# EAGLE design mainbrd (EAGLE 6.5.0)

## Sheet 1 of 2
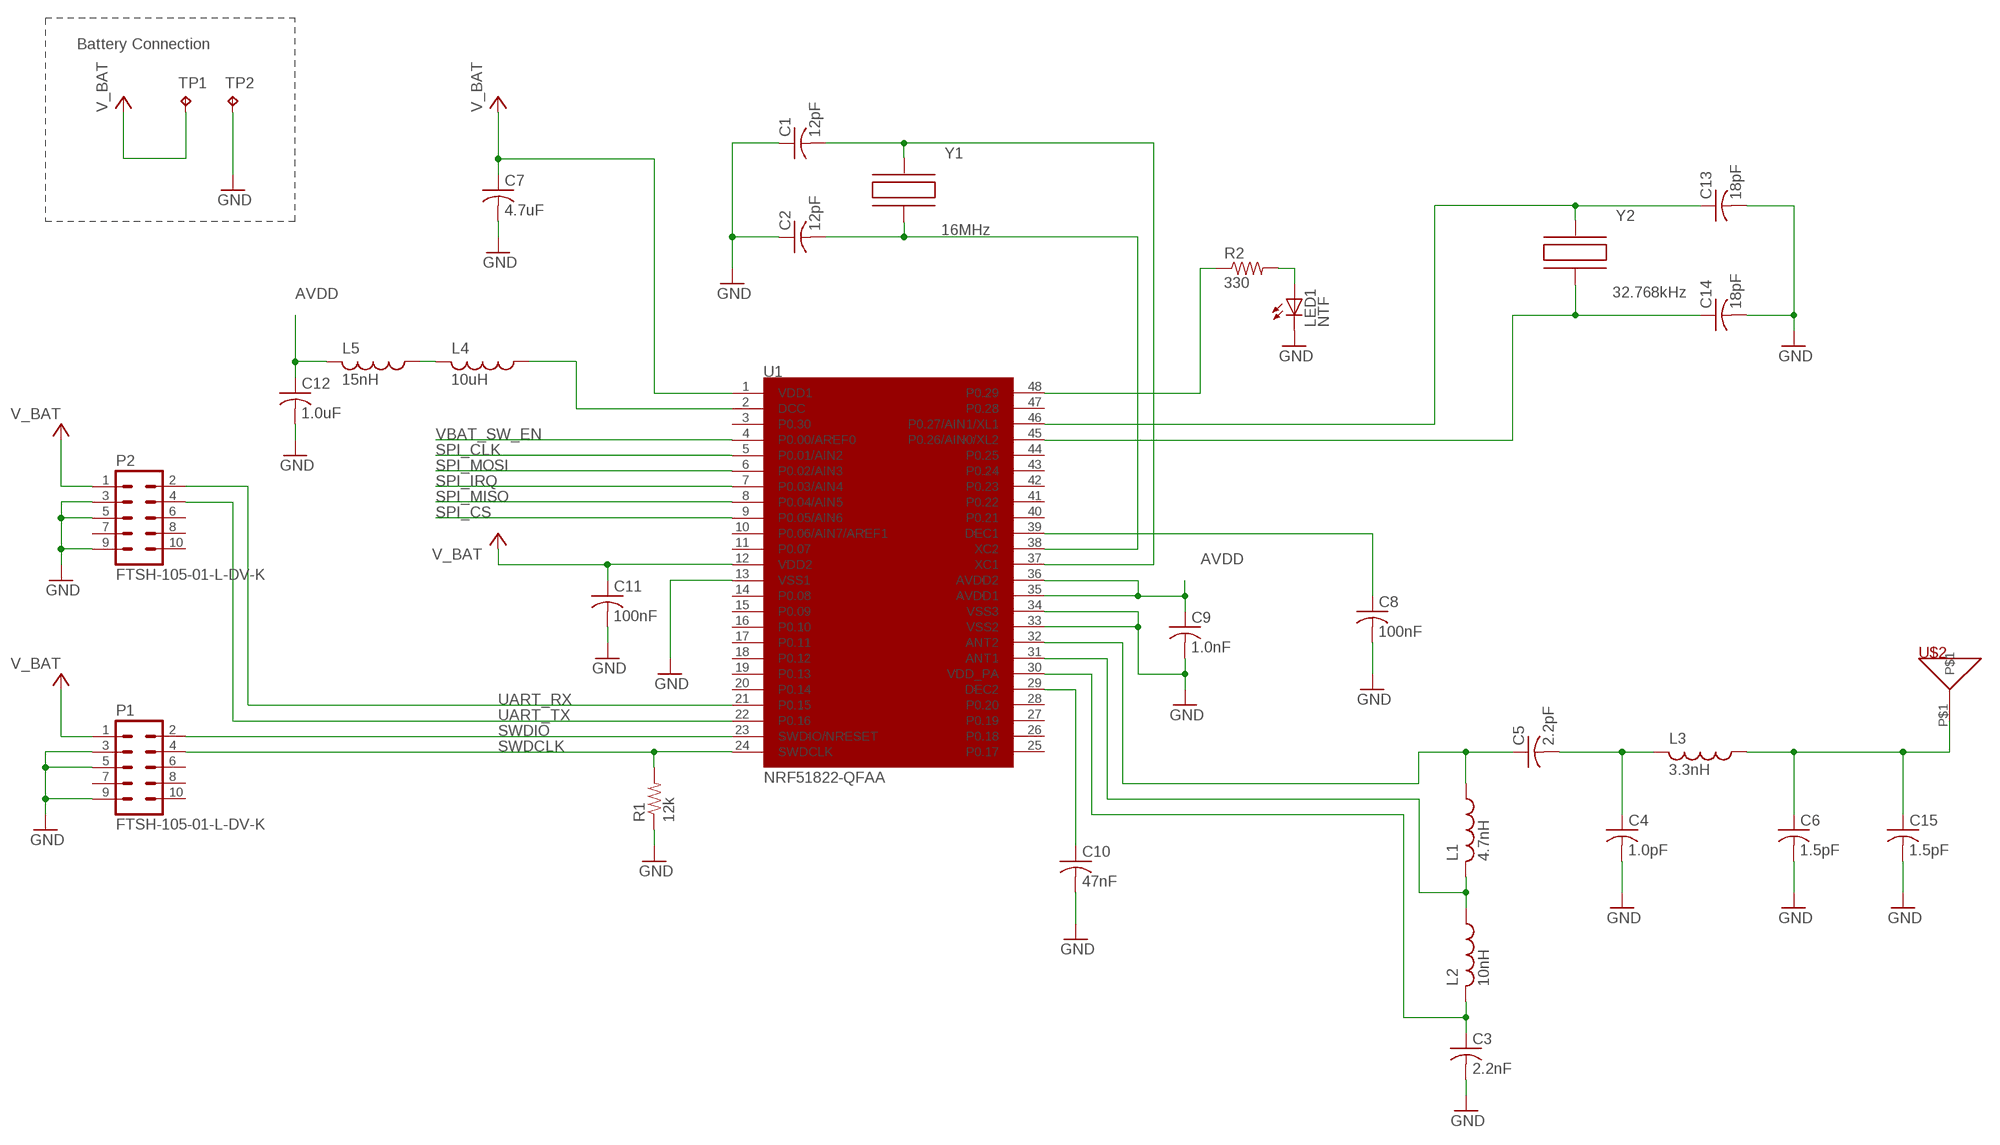
[diagram p0: schematic, sheet 1]

### Parts
C1  12pF  C-USC0402  [C0402]
C2  12pF  C-USC0402  [C0402]
C3  2.2nF  C-USC0402  [C0402]
C4  1.0pF  C-USC0402  [C0402]
C5  2.2pF  C-USC0402  [C0402]
C6  1.5pF  C-USC0402  [C0402]
C7  4.7uF  C-USC0603  [C0603]
C8  100nF  C-USC0402  [C0402]
C9  1.0nF  C-USC0402  [C0402]
C10  47nF  C-USC0402  [C0402]
C11  100nF  C-USC0402  [C0402]
C12  1.0uF  C-USC0603  [C0603]
C13  18pF  C-USC0402  [C0402]
C14  18pF  C-USC0402  [C0402]
C15  1.5pF  C-USC0402  [C0402]
L1  4.7nH  L-USL0402  [L0402]
L2  10nH  L-USL0402  [L0402]
L3  3.3nH  L-USL0402  [L0402]
L4  10uH  L-USL0603  [L0603]
L5  15nH  L-USL0402  [L0402]
LED1  NTF  LEDCHIP-LED0603  [CHIP-LED0603]
P1  FTSH-105-01-L-DV-K  [FTSH-105-01-L-DV-K]
P2  FTSH-105-01-L-DV-K  [FTSH-105-01-L-DV-K]
R1  12k  R-US_R0402  [R0402]
R2  330  R-US_R0402  [R0402]
TP1  TPPAD1-13  [P1-13]
TP2  TPPAD1-13  [P1-13]
U1  NRF51822-QFAA  [QFN48]
U$2  PCB_ANT  [PCB_ANT]
Y1  16MHz  T7V  [SMD_3225]
Y2  32.768kHz  ECX_39  [ECX-39]

### Nets
ANT: C6.1 C15.1 L3.1 U$2.P$1
AVDD: C9.1 C12.1 L5.2 U1.35(AVDD1) U1.36(AVDD2)
GND: C1.1 C2.1 C3.2 C4.2 C6.2 C7.2 C8.2 C9.2 C10.2 C11.2 C12.2 C13.2 C14.2 C15.2 LED1.C P1.3 P1.5 P1.9 P2.3 P2.5 P2.9 R1.1 TP2.TP U1.13(VSS1) U1.33(VSS2) U1.34(VSS3) ; also sheet 2
N$1: L4.1 U1.2(DCC)
N$2: L4.2 L5.1
N$3: C1.2 U1.37(XC1) Y1.3
N$4: C2.2 U1.38(XC2) Y1.1
N$5: C8.1 U1.39(DEC1)
N$6: C5.1 L1.1 U1.32(ANT2)
N$7: L1.2 L2.1 U1.31(ANT1)
N$8: C3.1 L2.2 U1.30(VDD_PA)
N$9: C10.1 U1.29(DEC2)
N$10: C4.1 C5.2 L3.2
N$14: C13.1 U1.46(P0.27/AIN1/XL1) Y2.2
N$15: C14.1 U1.45(P0.26/AIN0/XL2) Y2.1
N$16: R2.1 U1.48(P0.29)
N$17: LED1.A R2.2
SPI_CLK: U1.5(P0.01/AIN2) ; also sheet 2
SPI_CS: U1.9(P0.05/AIN6) ; also sheet 2
SPI_IRQ: U1.7(P0.03/AIN4) ; also sheet 2
SPI_MISO: U1.8(P0.04/AIN5) ; also sheet 2
SPI_MOSI: U1.6(P0.02/AIN3) ; also sheet 2
SWDCLK: P1.4 R1.2 U1.24(SWDCLK)
SWDIO: P1.2 U1.23(SWDIO/NRESET)
UART_RX: P2.2 U1.21(P0.15)
UART_TX: P2.4 U1.22(P0.16)
VBAT_SW_EN: U1.4(P0.00/AREF0) ; also sheet 2
VCC: C7.1 C11.1 P1.1 P2.1 TP1.TP U1.1(VDD1) U1.12(VDD2) ; supply symbol labelled V_BAT ; also sheet 2
Unconnected: P1.6 P1.7 P1.8 P1.10 P2.6 P2.7 P2.8 P2.10 U1.3(P0.30) U1.10(P0.06/AIN7/AREF1) U1.11(P0.07) U1.14(P0.08) U1.15(P0.09) U1.16(P0.10) U1.17(P0.11) U1.18(P0.12) U1.19(P0.13) U1.20(P0.14) U1.25(P0.17) U1.26(P0.18) U1.27(P0.19) U1.28(P0.20) U1.40(P0.21) U1.41(P0.22) U1.42(P0.23) U1.43(P0.24) U1.44(P0.25) U1.47(P0.28)

### Notes on the sheet
- Battery Connection

## Sheet 2 of 2
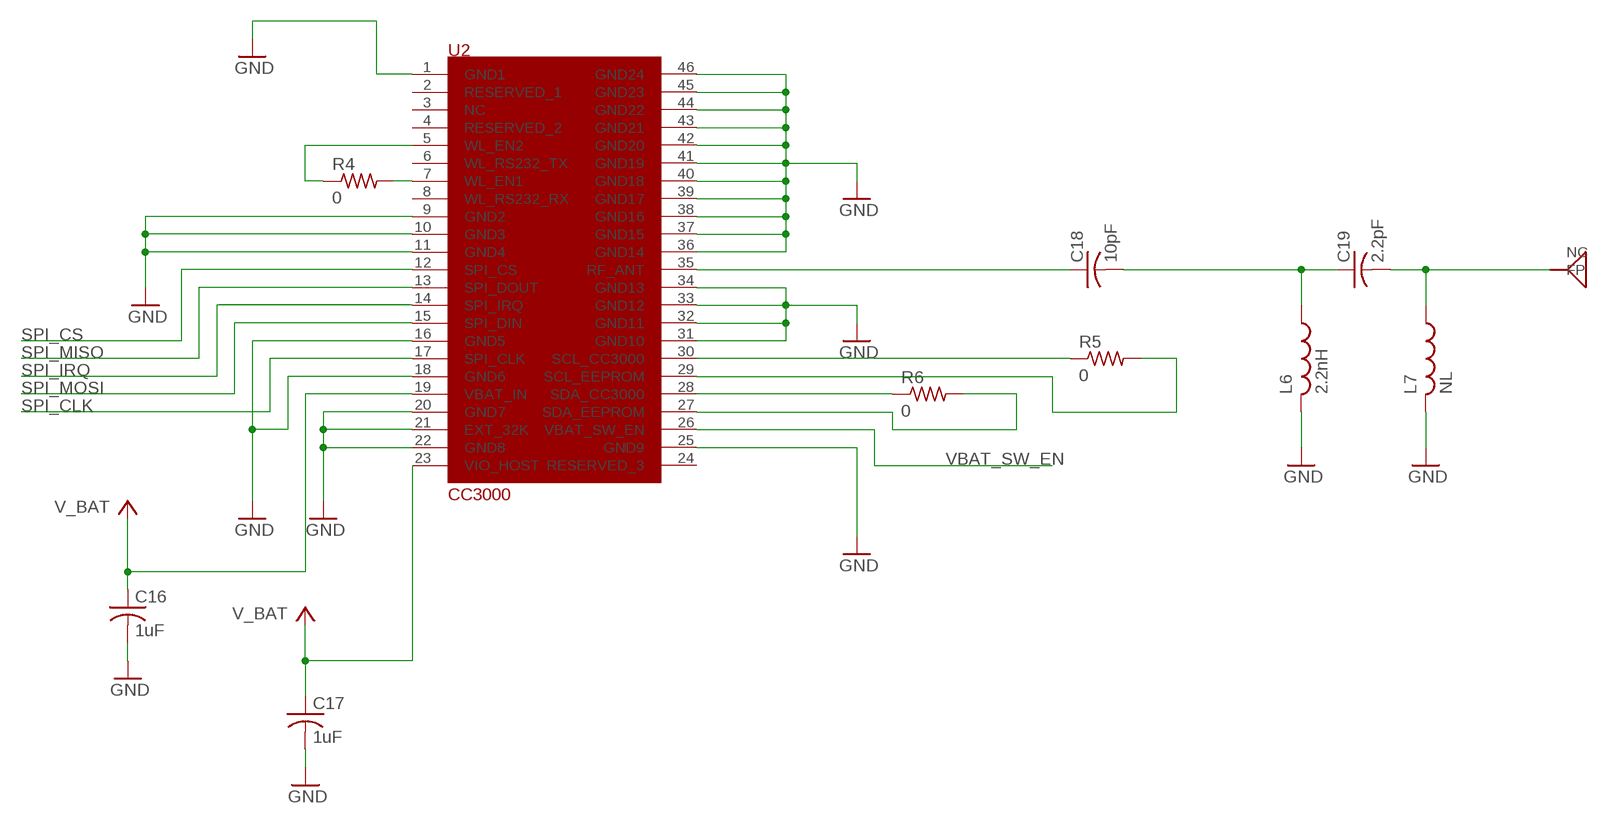
[diagram p1: schematic, sheet 2]

### Parts
C16  1uF  C-USC0402  [C0402]
C17  1uF  C-USC0402  [C0402]
C18  10pF  C-USC0402  [C0402]
C19  2.2pF  C-USC0402  [C0402]
L6  2.2nH  L-USL0402  [L0402]
L7  NL  L-USL0402  [L0402]
R4  0  R-US_R0402  [R0402]
R5  0  R-US_R0402  [R0402]
R6  0  R-US_R0402  [R0402]
U2  CC3000  [CC3000]
U$1  AT8010  [AT8010]

### Nets
GND: C16.2 C17.2 L6.2 L7.2 U2.1(GND1) U2.9(GND2) U2.10(GND3) U2.11(GND4) U2.16(GND5) U2.18(GND6) U2.20(GND7) U2.21(EXT_32K) U2.22(GND8) U2.25(GND9) U2.31(GND10) U2.32(GND11) U2.33(GND12) U2.34(GND13) U2.36(GND14) U2.37(GND15) U2.38(GND16) U2.39(GND17) U2.40(GND18) U2.41(GND19) U2.42(GND20) U2.43(GND21) U2.44(GND22) U2.45(GND23) U2.46(GND24) ; also sheet 1
N$12: C19.2 L7.1 U$1.FP
N$19: R4.1 U2.5(WL_EN2)
N$20: R4.2 U2.7(WL_EN1)
N$24: C18.2 C19.1 L6.1
N$26: C18.1 U2.35(RF_ANT)
N$27: R5.2 U2.29(SCL_EEPROM)
N$28: R5.1 U2.30(SCL_CC3000)
N$30: R6.2 U2.27(SDA_EEPROM)
N$31: R6.1 U2.28(SDA_CC3000)
SPI_CLK: U2.17(SPI_CLK) ; also sheet 1
SPI_CS: U2.12(SPI_CS) ; also sheet 1
SPI_IRQ: U2.14(SPI_IRQ) ; also sheet 1
SPI_MISO: U2.13(SPI_DOUT) ; also sheet 1
SPI_MOSI: U2.15(SPI_DIN) ; also sheet 1
VBAT_SW_EN: U2.26(VBAT_SW_EN) ; also sheet 1
VCC: C16.1 C17.1 U2.19(VBAT_IN) U2.23(VIO_HOST) ; supply symbol labelled V_BAT ; also sheet 1
Unconnected: U2.2(RESERVED_1) U2.3(NC) U2.4(RESERVED_2) U2.6(WL_RS232_TX) U2.8(WL_RS232_RX) U2.24(RESERVED_3) U$1.NC

## Library data of the parts
C1-C15 = rcl:C-US: CAPACITOR, American symbol
C16-C19 = rcl2:C-US: CAPACITOR, American symbol
L1-L7 = rcl2:L-US: INDUCTOR, American symbol
LED1 = led:LED: LED OSRAM: - CHIPLED LG R971, LG N971, LY N971, LG Q971, LY Q971, LO R971, LY R971 LH N974, LH R974 LS Q976, LO Q976, LY Q976 LO Q996 - Hyper CHIPLED LW Q18S LB Q993, LB Q99A, LB R99A - SideLED LS A670, LO A670, LY A670, LG A670, LP A670 LB A673, LV A673, LT A673, LW A673 LH A674 LY A675 LS A676, LA A676, LO A676, LY A676, LW A676 LS A679, LY A679, LG A679 - Hyper Micro SIDELED® LS Y876, LA Y876, LO Y876, LY Y876 LT Y87S - SmartLED LW L88C, LW L88S LB L89C, LB L89S, LG L890 LS L89K, LO L89K, LY L89K LS L896, LA L896, LO L896, LY L896 - TOPLED LS T670, LO T670, LY T670, LG T670, LP T670 LSG T670, LSP T670, LSY T670, LOP T670, LYG T670 LG T671, LOG T671, LSG T671 LB T673, LV T673, LT T673, LW T673 LH T674 LS T676, LA T676, LO T676, LY T676, LB T676, LH T676, LSB T676, LW T676 LB T67C, LV T67C, LT T67C, LS T67K, LO T67K, LY T67K, LW E67C LS E67B, LA E67B, LO E67B, LY E67B, LB E67C, LV E67C, LT E67C LW T67C LS T679, LY T679, LG T679 LS T770, LO T770, LY T770, LG T770, LP T770 LB T773, LV T773, LT T773, LW T773 LH T774 LS E675, LA E675, LY E675, LS T675 LS T776, LA T776, LO T776, LY T776, LB T776 LHGB T686 LT T68C, LB T68C - Hyper Mini TOPLED® LB M676 - Mini TOPLED Santana® LG M470 LS M47K, LO M47K, LY M47K Source: http://www.osram.convergy.de LUXEON: - LUMILED® LXK2-PW12-R00, LXK2-PW12-S00, LXK2-PW14-U00, LXK2-PW14-V00 LXK2-PM12-R00, LXK2-PM12-S00, LXK2-PM14-U00 LXK2-PE12-Q00, LXK2-PE12-R00, LXK2-PE12-S00, LXK2-PE14-T00, LXK2-PE14-U00 LXK2-PB12-K00, LXK2-PB12-L00, LXK2-PB12-M00, LXK2-PB14-N00, LXK2-PB14-P00, LXK2-PB14-Q00 LXK2-PR12-L00, LXK2-PR12-M00, LXK2-PR14-Q00, LXK2-PR14-R00 LXK2-PD12-Q00, LXK2-PD12-R00, LXK2-PD12-S00 LXK2-PH12-R00, LXK2-PH12-S00 LXK2-PL12-P00, LXK2-PL12-Q00, LXK2-PL12-R00 Source: www.luxeon.com KINGBRIGHT: KA-3528ASYC Source: www.kingbright.com
P1 P2 = con-samtec:FTSH-105-01-L-DV-K: FTSH Pin Header
R1 R2 = rcl2:R-US_: RESISTOR, American symbol
R4-R6 = rcl:R-US_: RESISTOR, American symbol
TP1 TP2 = testpad:TP: Test pad
U1 = SmartNodeLib:NRF51822-QFAA
U2 = SmartNodeLib:CC3000
U$1 = SmartNodeLib:AT8010
U$2 = SmartNodeLib:PCB_ANT
Y1 = SmartNodeLib:T7V
Y2 = SmartNodeLib:ECX_39

## Board
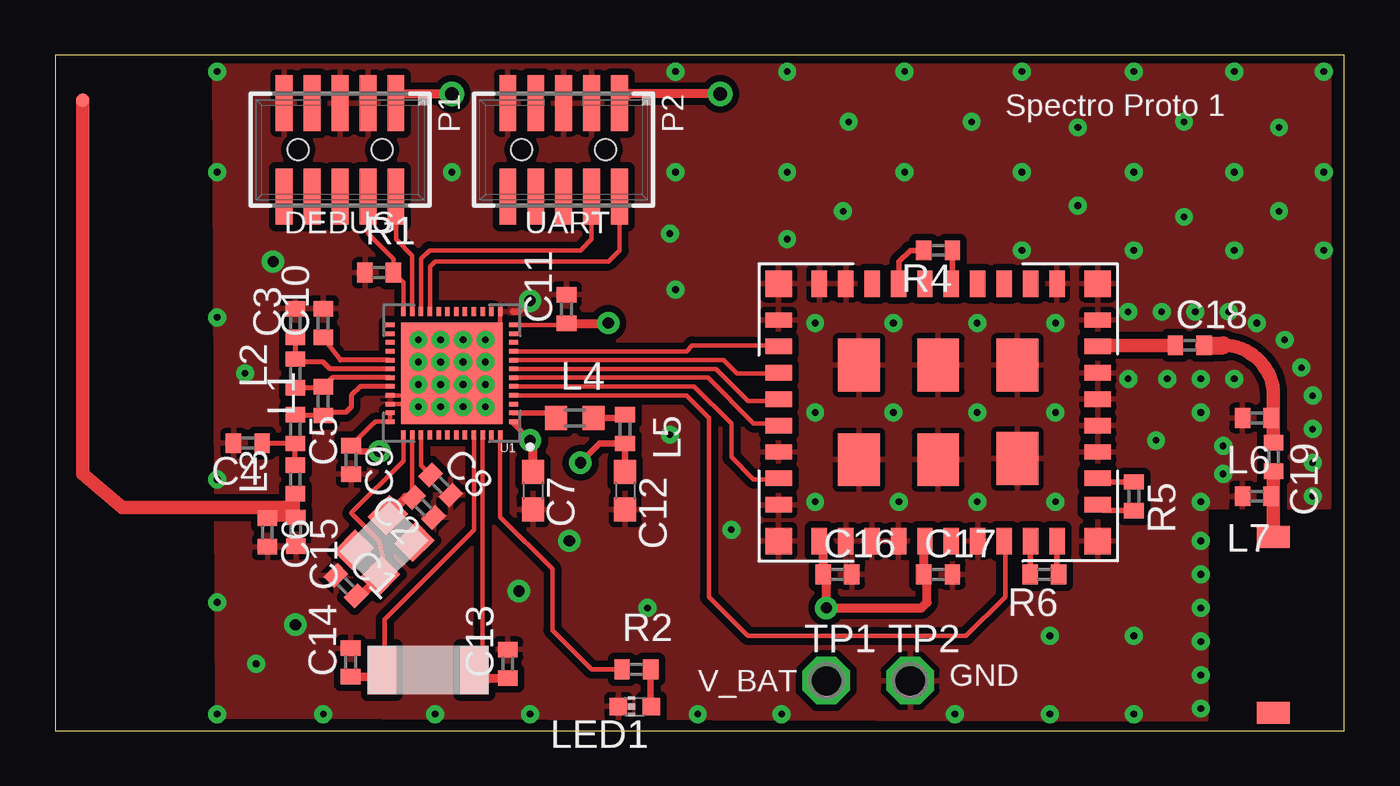
[diagram p2: board, top side]
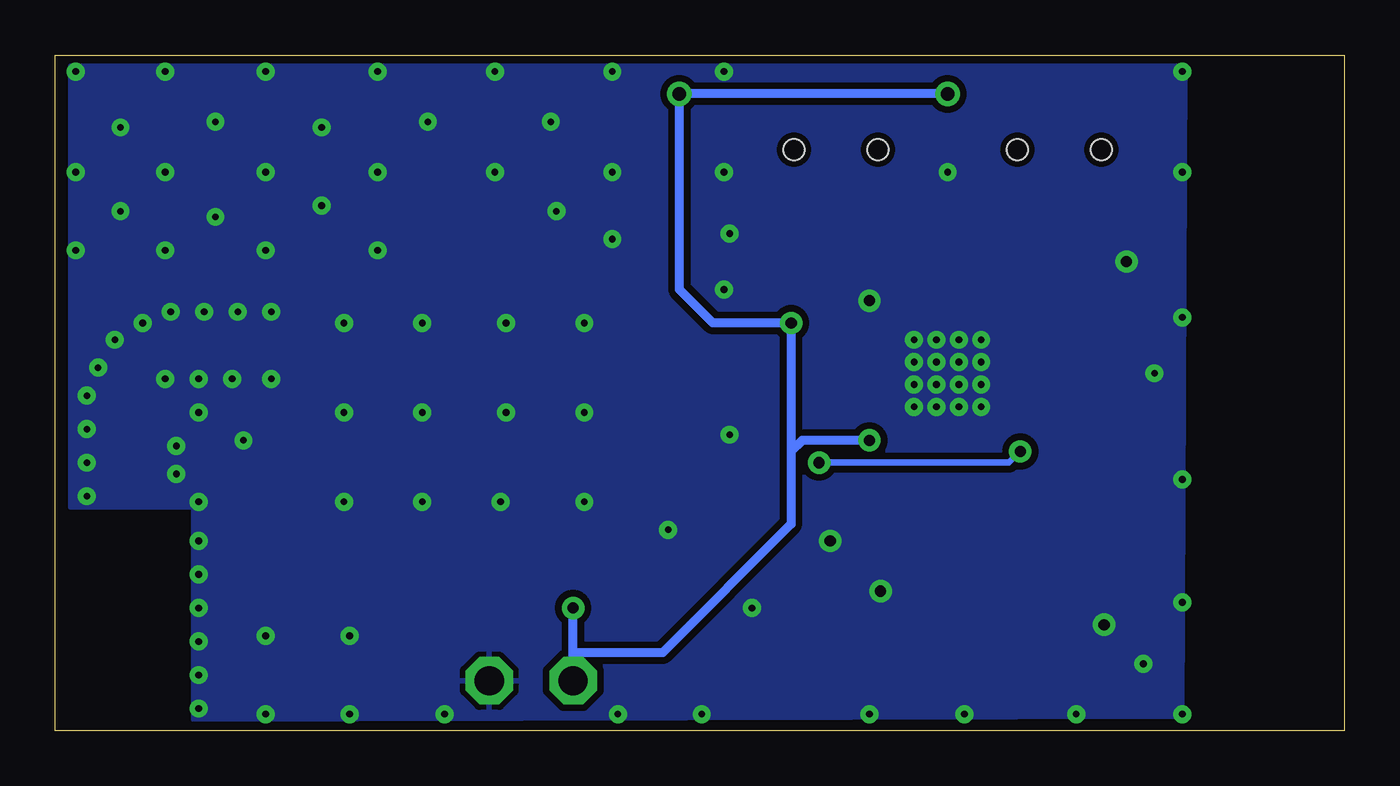
[diagram p3: board, bottom side, seen from below]

Size 58.6 x 30.72 mm. Coordinates in mm from the lower left corner, seen from the top.
Outline: 0,0 58.6,0 58.6,30.72 0,30.72 0,0
Copper layers (1*16): Top 0.035mm / dielectric 1.5mm / Bottom 0.035mm
Design rules "SparkFun *": minimum track width 8mil, minimum drill 12mil, track to track 6mil, track to pad 6mil, pad to pad 7mil, via to via 8mil, smd to smd 6mil, copper to edge 10mil, drill to drill 6mil, minimum pad ring 12mil, minimum via ring 10mil, stop-mask expansion 4mil, vias tented up to drill 25mil, thermal gap 10mil

### Footprints (pad centres in the part's own frame; a part is rotated, then mirrored left to right if it is on the bottom)
C0402 = smd 0.7 x 0.9: 1 -0.65,0; 2 0.65,0
C0603 = smd 1.1 x 1: 1 -0.85,0; 2 0.85,0
L0402 = smd 0.7 x 0.9: 1 -0.65,0; 2 0.65,0
L0603 = smd 1 x 1.1: 1 -0.85,0; 2 0.85,0
CHIP-LED0603 = smd 0.8 x 0.8: A 0,-0.75; C 0,0.75
FTSH-105-01-L-DV-K = smd 0.762 x 2.54: 1 -2.54,-2.121; 2 -2.54,2.121; 3 -1.27,-2.121; 4 -1.27,2.121; 5 0,-2.121; 6 0,2.121; 7 1.27,-2.121; 8 1.27,2.121; 9 2.54,-2.121; 10 2.54,2.121 | hole 0.94: -1.905,0; 1.905,0
R0402 = smd 0.7 x 0.9: 1 -0.65,0; 2 0.65,0
P1-13 = drill 1.321 pad 2.159 octagon: TP 0,0
QFN48 = smd 0.406 x 0.203: 1 -2.8,2.2; 2 -2.8,1.8; 3 -2.8,1.4; 4 -2.8,1; 5 -2.8,0.6; 6 -2.8,0.2; 7 -2.8,-0.2; 8 -2.8,-0.6; 9 -2.8,-1; 10 -2.8,-1.4; 11 -2.8,-1.8; 12 -2.8,-2.2; 25 2.8,-2.2; 26 2.8,-1.8; 27 2.8,-1.4; 28 2.8,-1; 29 2.8,-0.6; 30 2.8,-0.2; 31 2.8,0.2; 32 2.8,0.6; 33 2.8,1; 34 2.8,1.4; 35 2.8,1.8; 36 2.8,2.2 | smd 0.203 x 0.406: 13 -2.2,-2.8; 14 -1.8,-2.8; 15 -1.4,-2.8; 16 -1,-2.8; 17 -0.6,-2.8; 18 -0.2,-2.8; 19 0.2,-2.8; 20 0.6,-2.8; 21 1,-2.8; 22 1.4,-2.8; 23 1.8,-2.8; 24 2.2,-2.8; 37 2.2,2.8; 38 1.8,2.8; 39 1.4,2.8; 40 1,2.8; 41 0.6,2.8; 42 0.2,2.8; 43 -0.2,2.8; 44 -0.6,2.8; 45 -1,2.8; 46 -1.4,2.8; 47 -1.8,2.8; 48 -2.2,2.8 | smd 4.6 x 4.6: P$1 0,0
CC3000 = smd 1.2 x 0.7: 1 -5.85,5.4; 2 -5.85,4.2; 3 -5.85,3; 4 -5.85,1.8; 5 -5.85,0.6; 6 -5.85,-0.6; 7 -5.85,-1.8; 8 -5.85,-3; 9 -5.85,-4.2; 10 -5.85,-5.4; 19 5.85,-5.4; 20 5.85,-4.2; 21 5.85,-3; 22 5.85,-1.8; 23 5.85,-0.6; 24 5.85,0.6; 25 5.85,1.8; 26 5.85,3; 27 5.85,4.2; 28 5.85,5.4 | smd 0.7 x 1.2: 11 -4.2,-7.25; 12 -3,-7.25; 13 -1.8,-7.25; 14 -0.6,-7.25; 15 0.6,-7.25; 16 1.8,-7.25; 17 3,-7.25; 18 4.2,-7.25; 29 4.2,7.25; 30 3,7.25; 31 1.8,7.25; 32 0.6,7.25; 33 -0.6,7.25; 34 -1.8,7.25; 35 -3,7.25; 36 -4.2,7.25 | smd 2.4 x 1.9: 37 -2.15,3.6; 38 -2.15,0; 39 -2.15,-3.6; 40 2.1,3.6; 41 2.15,0; 42 2.15,-3.6 | smd 1.2 x 1.2: 43 -5.85,7.25; 44 -5.85,-7.25; 45 5.85,-7.25; 46 5.85,7.25
AT8010 = smd 1 x 1.5: FP -4,0; NC 4,0
PCB_ANT = smd 0.61 x 0.61: P$1 0,-0.04
SMD_3225 = smd 1.4 x 1.2: 1 -1.1,-0.9; 2 1.1,-0.9; 3 1.1,0.8; 4 -1.1,0.8
ECX-39 = smd 1.3 x 2.2: 1 -2.1,0; 2 2.1,0

### Placement (x,y rotation side)
C1  13.22,6.6 315 top
C2  16.75,10.16 135 top
C3  10.92,18.54 90 top
C4  8.76,13.08 180 top
C5  10.92,13.72 270 top
C6  9.65,9.02 270 top
C7  21.72,10.92 270 top
C8  17.53,11.18 315 top
C9  13.46,12.32 270 top
C10  12.19,18.54 90 top
C11  23.24,19.18 90 top
C12  25.91,10.92 270 top
C13  20.57,3.05 90 top
C14  13.43,3.11 90 top
C15  10.95,9.05 270 top
C16  35.56,7.11 0 top
C17  40.13,7.11 0 top
C18  51.56,17.53 0 top
C19  55.37,12.45 270 top
L1  12.19,14.99 90 top
L2  10.92,16.26 90 top
L3  10.92,11.43 90 top
L4  23.62,14.22 0 top
L5  25.91,13.72 270 top
L6  54.61,14.22 180 top
L7  54.61,10.67 180 top
LED1  26.35,1.11 90 top
P1  12.95,26.42 180 top
P2  23.11,26.42 180 top
R1  14.73,20.83 0 top
R2  26.42,2.79 0 top
R4  40.13,21.84 180 top
R5  49.02,10.67 270 top
R6  44.96,7.11 180 top
TP1  35.05,2.29 0 top
TP2  38.86,2.29 0 top
U1  18.03,16.26 180 top
U2  40.13,14.48 270 top
U$1  55.37,4.83 270 top
U$2  1.27,28.7 0 top
Y1  14.99,8.38 225 top
Y2  16.96,2.76 0 top

### Tracks (layer width: path | path; a pad name or v marks a point on that pad's centre or on a via)
ANT
  Top 0.406: L3.1 10.92,9.73 C15.1 | C15.1 9.69,9.7 C6.1 | C15.1 10.95,9.88 10.67,10.16
  Top 0.61: U$2.P$1 1.27,11.68 3.05,10.16 10.67,10.16
AVDD  (via drill 0.51)
  Top 0.203: U1.35 U1.36 14.56,14.06 14.48,13.97 14.46,13.97 C9.1
  Top 0.305: C12.1 L5.2 24.75,13.07 v23.88,12.19 | v14.73,12.7 13.73,12.7 C9.1
  Bottom 0.305: v23.88,12.19 15.24,12.19 v14.73,12.7
GND  (via drill 0.3 pad 0.15, 0.51)
  Top 0.203: 20.82,19.06 20.83,19.05 | U1.33 16.02,15.26 v16.51,15.75 | U1.34 16.39,14.86 v16.51,14.73 | U1.13 20.23,18.46 v19.56,17.78
  Top 0.305: 20.82,19.06 21.09,19.06 v21.59,19.56
  other vias: 10.92,4.83 21.08,6.35 23.37,8.64 52.07,10.41 53.09,11.68 48.77,16 49.02,4.32 52.07,8.64 52.07,7.11 52.07,5.59 52.07,4.06 52.07,2.54 52.07,1.02 57.15,10.67 57.15,12.19 56.64,16.51 57.15,13.72 57.15,15.24 51.82,19.05 50.29,19.05 48.77,19.05 50.55,16 52.07,16 53.59,16 53.09,12.95 49.02,0.76 7.37,25.4 7.37,0.76 7.37,18.8 7.37,11.43 7.37,5.84 28.19,25.4 33.27,25.4 38.61,25.4 43.94,25.4 54.61,18.54 52.07,14.48 12.19,0.76 17.27,0.76 21.59,0.76 29.21,0.76 33.02,0.76 40.89,0.76 45.21,0.76 45.21,4.32 26.92,5.59 30.73,9.14 27.94,13.46 28.19,20.07 33.27,22.35 43.94,21.84 53.34,19.05 41.91,14.48 38.1,14.48 27.94,22.61 38.1,18.54 38.35,10.41 41.91,18.54 41.91,10.41 45.47,10.41 45.47,14.48 45.47,18.54 34.54,18.54 34.54,14.48 34.54,10.41 9.91,21.34 17.53,14.73 18.54,14.73 19.56,14.73 17.53,15.75 18.54,15.75 19.56,15.75 19.56,16.76 18.54,16.76 17.53,16.76 16.51,16.76 16.51,17.78 17.53,17.78 18.54,17.78 55.88,17.78 49.02,21.84 49.02,25.4 53.59,25.4 57.66,25.4 57.66,21.84 53.59,21.84 28.19,29.97 33.27,29.97 38.61,29.97 53.59,29.97 49.02,29.97 43.94,29.97 57.66,29.97 18.03,25.4 36.07,27.69 41.66,27.69 46.48,27.43 51.31,27.69 55.63,27.43 35.81,23.62 46.48,23.88 51.31,23.37 55.63,23.62 8.64,16.26 9.14,3.05 7.37,29.97 50.04,13.21
  pour Top (isolate 0.305): 7.37,0.63 7.24,30.23 57.91,30.23 57.91,10.16 52.32,10.16 52.32,0.51
  pour Bottom (isolate 0.305): 7.24,30.23 7.37,0.63 52.32,0.51 52.32,10.16 57.91,10.16 57.91,30.23
N$1
  Top 0.254: U1.2 22.54,14.46
  Top 0.305: 22.54,14.46 L4.1
N$2
  Top 0.305: L4.2 25.77,14.22 L5.1
N$3
  Top 0.203: U1.37 15.83,12.28 13.46,9.91 14.73,8.64 14.99,7.51 Y1.3
  Top 0.406: C1.2 13.88,6.14 Y1.3
  Top 0.61: Y1.3 14.58,7.29
N$4
  Top 0.203: U1.38 16.23,11.07 C2.2
  Top 0.406: C2.2 15.95,10.62 Y1.1
N$5
  Top 0.203: U1.39 16.63,12.07 C8.1
N$6
  Top 0.229: U1.32 13.88,15.66 13.46,15.24 13.46,14.73 13.21,14.48 12.33,14.48 L1.1 12.16,14.37 C5.1
N$7
  Top 0.229: U1.31 12.61,16.06 L1.2 12.16,15.61 L2.1
N$8
  Top 0.229: U1.30 12.5,16.46 12.19,16.76 11.06,16.76 L2.2 C3.1
N$9
  Top 0.229: U1.29 12.97,16.86 C10.1
N$10
  Top 0.229: C4.1 10.91,13.08 | L3.2 C5.2
  Top 0.406: 10.91,13.08 C5.2
N$12
  Top 0.61: C19.2 55.37,10.67 | L7.1 55.37,10.67 | 55.37,10.67 U$1.FP
N$14
  Top 0.203: U1.46 19.43,3.17 19.56,3.05 19.34,3.05 Y2.2
  Top 0.381: C13.1 19.42,2.4
  Top 0.813: 19.42,2.4 Y2.2
N$15
  Top 0.203: U1.45 19.03,9.16 19.05,9.14 14.99,5.08 14.99,2.89 Y2.1
  Top 0.381: C14.1 14.56,2.46
  Top 0.813: 14.56,2.46 Y2.1
N$16
  Top 0.203: U1.48 20.23,9.74 22.61,7.37 22.61,4.57 24.38,2.79 R2.1
N$17
  Top 0.305: R2.2 27.07,1.15 LED1.A
N$19
  Top 0.254: R4.1 40.78,20.38 U2.5
N$20
  Top 0.254: R4.2 38.86,21.84 38.35,21.34 38.35,20.35 U2.7
N$24
  Top 0.61: 53.09,17.53 arc-90 55.37,15.24 55.37,14.22 | L6.1 55.37,14.22 | 55.37,14.22 C19.1
  Top 0.813: C18.2 53.09,17.53
N$26
  Top 0.61: C18.1 47.43,17.53 U2.35
N$27
  Top 0.254: R5.2 47.64,10.02 U2.29
N$28
  Top 0.254: R5.1 47.54,11.32 U2.30
N$30
  Top 0.254: U2.27 44.33,7.14 R6.2
N$31
  Top 0.254: U2.28 45.53,7.19 R6.1
SPI_CLK
  Top 0.203: U1.5 29.05,15.66 30.73,13.97 30.73,12.45 31.75,11.43 32.83,11.43 U2.17
SPI_CS
  Top 0.203: U1.9 28.69,17.26 28.96,17.53 32.83,17.53 U2.12
SPI_IRQ
  Top 0.203: U1.7 30.03,16.46 31.5,14.99 32.79,14.99 U2.14
SPI_MISO
  Top 0.203: U1.8 30.39,16.86 30.99,16.26 32.86,16.26 U2.13
SPI_MOSI
  Top 0.203: U1.6 29.66,16.06 31.75,13.97 32.79,13.97 U2.15
SWDCLK
  Top 0.203: U1.24 15.83,20.38 R1.2 15.38,21.45 14.22,22.61 P1.4
SWDIO
  Top 0.203: U1.23 16.23,21.61 15.49,22.35 P1.2
UART_RX
  Top 0.203: U1.21 17.03,21.1 17.27,21.34 25.15,21.34 25.65,21.84 P2.2
UART_TX
  Top 0.203: U1.22 16.63,21.46 17.02,21.84 23.88,21.84 24.38,22.35 P2.4
VBAT_SW_EN
  Top 0.203: U1.4 28.69,15.26 29.72,14.22 29.72,6.1 31.5,4.32 41.4,4.32 43.18,6.1 43.18,8.58 U2.26
VCC  (via drill 0.51, 0.6)
  Top 0.203: U1.12 23.17,18.46 | 20.83,13.96 U1.1
  Top 0.254: 20.83,13.96 v21.59,13.21
  Top 0.406: U2.19 34.91,8.45 C16.1 35.05,6.97 v35.05,5.59 39.37,5.59 39.62,5.84 39.62,6.97 C17.1 | 39.34,6.97 C17.1 | C17.1 39.48,8.58 | v25.15,18.54 25.13,18.53 C11.1 23.17,18.46 | C7.1 21.72,13.08 v21.59,13.21 | v30.23,28.96 26.07,28.96 P2.1 | P1.1 15.49,28.96 v18.03,28.96
  Top 0.61: 39.48,8.58 39.53,8.58 U2.23
  Bottom 0.406: TP1.TP 35.05,3.3 | 35.05,3.3 v35.05,5.59 | 25.15,12.7 v25.15,18.54 28.7,18.54 30.23,20.07 v30.23,28.96 v18.03,28.96 | 25.15,12.7 25.15,9.4 30.99,3.56 34.8,3.56 35.05,3.3 | v21.59,13.21 24.64,13.21 25.15,12.7

### Text on the board
tPlace: Spectro Proto 1 | DEBUG | UART | V_BAT | GND